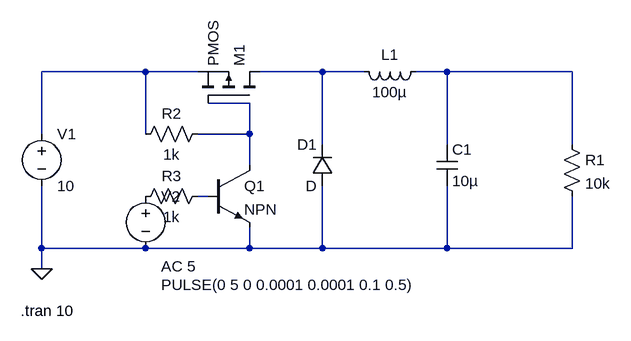
[diagram p0: schematic Buck converter.asc]
Buck converter.asc, the LTspice schematic file:
Version 4
SHEET 1 880 680
WIRE 96 64 -64 64
WIRE 176 64 96 64
WIRE 368 64 272 64
WIRE 432 64 368 64
WIRE 560 64 512 64
WIRE 752 64 560 64
WIRE 256 112 192 112
WIRE -64 160 -64 64
WIRE 96 160 96 64
WIRE 256 160 256 112
WIRE 256 160 176 160
WIRE 368 176 368 64
WIRE 560 176 560 64
WIRE 752 176 752 64
WIRE 256 208 256 160
WIRE 192 256 176 256
WIRE -64 336 -64 240
WIRE 96 336 -64 336
WIRE 256 336 256 304
WIRE 256 336 96 336
WIRE 368 336 368 240
WIRE 368 336 256 336
WIRE 560 336 560 240
WIRE 560 336 368 336
WIRE 752 336 752 256
WIRE 752 336 560 336
WIRE -64 368 -64 336
FLAG -64 368 0
SYMBOL voltage -64 144 R0
WINDOW 123 0 0 Left 0
WINDOW 39 0 0 Left 0
SYMATTR InstName V1
SYMATTR Value 10
SYMBOL pmos 272 112 M270
SYMATTR InstName M1
SYMBOL ind 528 48 R90
WINDOW 0 5 56 VBottom 2
WINDOW 3 32 56 VTop 2
SYMATTR InstName L1
SYMATTR Value 100µ
SYMBOL diode 384 240 R180
WINDOW 0 24 64 Left 2
WINDOW 3 24 0 Left 2
SYMATTR InstName D1
SYMBOL res 736 160 R0
SYMATTR InstName R1
SYMATTR Value 10k
SYMBOL res 192 144 R90
WINDOW 0 0 56 VBottom 2
WINDOW 3 32 56 VTop 2
SYMATTR InstName R2
SYMATTR Value 1k
SYMBOL npn 192 208 R0
SYMATTR InstName Q1
SYMBOL voltage 96 240 R0
WINDOW 3 24 152 Left 2
WINDOW 123 24 124 Left 2
WINDOW 39 0 0 Left 0
SYMATTR Value PULSE(0 5 0 0.0001 0.0001 0.1 0.5)
SYMATTR Value2 AC 5
SYMATTR InstName V2
SYMBOL res 192 240 R90
WINDOW 0 0 56 VBottom 2
WINDOW 3 32 56 VTop 2
SYMATTR InstName R3
SYMATTR Value 1k
SYMBOL cap 544 176 R0
SYMATTR InstName C1
SYMATTR Value 10µ
TEXT -96 432 Left 2 !.tran 10

The netlist it stands for:
* Buck converter.asc
V1 N001 0 10
M1 N002 N004 N001 N001 PMOS
L1 N003 N002 100µ
D1 0 N002 D
R1 N003 0 10k
R2 N004 N001 1k
Q1 N004 N005 0 0 NPN
V2 P001 0 PULSE(0 5 0 0.0001 0.0001 0.1 0.5) AC 5
R3 N005 P001 1k
C1 N003 0 10µ
.model D D
.lib standard.dio
.model NPN NPN
.model PNP PNP
.lib standard.bjt
.model NMOS NMOS
.model PMOS PMOS
.lib standard.mos
.tran 10
.backanno
.end